# Altium schematic sheet Блок2.SchDoc
size A4
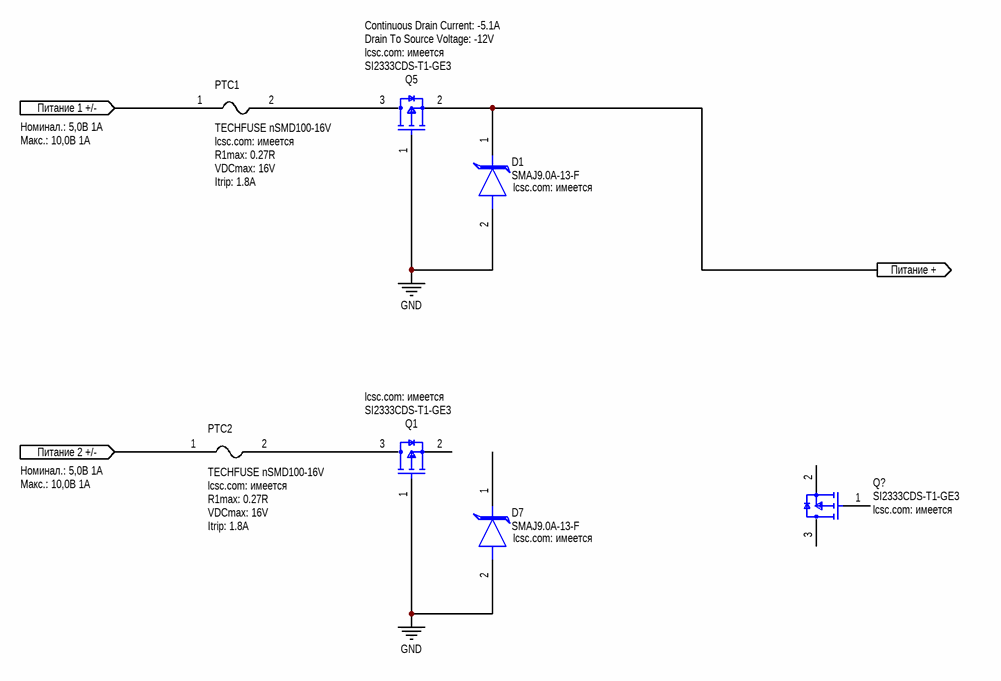
[diagram p0: Блок2.SchDoc]

## Parts
D1  SMAJ9.0A-13-F  lcsc.com: имеется  [FP-SMA-MFG]
D7  SMAJ9.0A-13-F  lcsc.com: имеется  [FP-SMA-MFG]
PTC1  TECHFUSE nSMD100-16V  lcsc.com: имеется  R1max: 0.27R  VDCmax: 16V  Itrip: 1.8A  [nSMD100-16V]
PTC2  TECHFUSE nSMD100-16V  lcsc.com: имеется  R1max: 0.27R  VDCmax: 16V  Itrip: 1.8A  [nSMD100-16V]
Q1  SI2333CDS-T1-GE3  lcsc.com: имеется  [FP-S-03946-MFG]
Q5  SI2333CDS-T1-GE3  Continuous Drain Current: -5.1A  Drain To Source Voltage: -12V  lcsc.com: имеется  [FP-S-03946-MFG]
Q?  SI2333CDS-T1-GE3  lcsc.com: имеется  [FP-S-03946-MFG]

## Ports
Питание 1 +/- (in), Питание 2 +/- (in), Питание + (out)

## Nets
GND: D1.2(A) D7.2(A) Q1.1(G) Q5.1(G)
Питание 1 +/-: PTC1.1 ; port Питание 1 +/-
Питание 2 +/-: PTC2.1 ; port Питание 2 +/-
Питание +: D1.1(C) Q5.2(S) ; port Питание +
NetPTC1_2: PTC1.2 Q5.3(D)
NetPTC2_2: PTC2.2 Q1.3(D)

Not connected (* = marked no-connect by the designer): D7 1(C); Q1 2(S); Q? 1(G) 2(S) 3(D)

## Library data of the parts
D1 D7 = CMP-12828-000014-1: TVS DIODE 9V 15.4V SMA; Manufacturer: Diodes Inc; Number Of Channels: 1; Standoff Height: 0.05mm; Max Junction Temp: +150°C; Direction: Unidirectional; Breakdown Voltage: 10V; Peak Pulse Current: 26A; Peak Pulse Power: 400W; Category: Diode; Footprint Url: https://www.diodes.com/assets/Package-Files/SMA.pdf; Lead Free: Yes; Mouser Description: TVS Diodes - Transient Voltage Suppressors 400W 9.0V; Automotive: No; Temperature Range Low: -55°C; Temperature Range High: +150°C; Manufacturer Part Number: SMAJ9.0A-13-F; RoHS: TRUE; Octopart: https://octopart.com/smaj9.0a-13-f-diodes+inc.-350369; Device Class L3: unset; Device Class L2: TVS Diodes; Clamping Voltage: 15.4V; Temperature: -55°C to +150°C; ComponentLink2Description: Datasheet; Package: SMA; Reverse Standoff Voltage: 9V; Digikey Description: TVS DIODE 9V 15.4V SMA; Height: 2.4mm; ComponentLink2URL: https://www.diodes.com/assets/Datasheets/ds19005.pdf; Device Class L1: Circuit Protection; lcsc.com link: https://lcsc.com/product-detail/TVS_Diodes-Incorporated-SMAJ9-0CA-13-F_C135023.html
Q1 Q? = CMP-02550-000209-1: MOSFET P-CH 12V 7.1A SOT-23; Manufacturer: Vishay; Gate To Source Voltage: 8V; Pulse Drain Current: -20A; Transconductance: 18.5S; Drain To Source Breakdown Voltage: -12V; Turn On Delay Time: 13ns; Turn Off Delay Time: 45ns; Max Forward Diode Voltage: -1.2V; Gate Charge At Vgs: 15nC @ -4.5V; Reverse Recovery Time: 32ns; Depletion Mode: False; Typ Forward Diode Voltage: -0.7V; Drain To Source Resistance: 0.0285Ω; Rthja Max: 75°C/W; Continuous Drain Current: -5.1A; Max Junction Temp: +150°C; Reverse Recovery Charge: 20nC; Number Of Channels: 1; Threshold Vgs Max: -1V; Standoff Height: 0.01mm; Input Capacitace At Vds: 1225pF @ -6V; Power Dissipation: 1.25W; Threshold Vgs Min: -0.4V; Temperature: -55°C to +150°C; Package: S-03946; Lead Free: Yes; Mouser Description: MOSFET 12V 5.1A 2.5W 35 mohms @ 4.5V; ComponentLink2Description: Datasheet; Automotive: No; Ipc Land Pattern Name: SOT95P237X100-3; ComponentLink2URL: http://www.vishay.com/docs/68717/si2333cd.pdf; Octopart: https://octopart.com/si2333cds-t1-ge3-vishay-43171447; Temperature Range High: +150°C; Digikey Description: MOSFET P-CH 12V 7.1A SOT-23; Category: Trans; Device Class L2: Transistors; Manufacturer Part Number: SI2333CDS-T1-GE3; RoHS: TRUE; Drain To Source Voltage: -12V; Device Class L3: MOSFETs; Height: 1.12mm; Number Of P Channels: 1; Temperature Range Low: -55°C; Device Class L1: Discrete Semiconductors; lcsc.com link: https://lcsc.com/product-detail/MOSFETs_Vishay-Intertech-SI2333CDS-T1-GE3_C48179.html
Q5 = CMP-02550-000209-1: MOSFET P-CH 12V 7.1A SOT-23; Manufacturer: Vishay; Gate To Source Voltage: 8V; Pulse Drain Current: -20A; Transconductance: 18.5S; Turn On Delay Time: 13ns; Turn Off Delay Time: 45ns; Max Forward Diode Voltage: -1.2V; Gate Charge At Vgs: 15nC @ -4.5V; Reverse Recovery Time: 32ns; Depletion Mode: False; Typ Forward Diode Voltage: -0.7V; Drain To Source Resistance: 0.0285Ω; Rthja Max: 75°C/W; Max Junction Temp: +150°C; Reverse Recovery Charge: 20nC; Number Of Channels: 1; Threshold Vgs Max: -1V; Standoff Height: 0.01mm; Input Capacitace At Vds: 1225pF @ -6V; Power Dissipation: 1.25W; Threshold Vgs Min: -0.4V; Temperature: -55°C to +150°C; Package: S-03946; Lead Free: Yes; Drain To Source Breakdown Voltage: -12V; Mouser Description: MOSFET 12V 5.1A 2.5W 35 mohms @ 4.5V; ComponentLink2Description: Datasheet; Automotive: No; Ipc Land Pattern Name: SOT95P237X100-3; ComponentLink2URL: http://www.vishay.com/docs/68717/si2333cd.pdf; Octopart: https://octopart.com/si2333cds-t1-ge3-vishay-43171447; Temperature Range High: +150°C; Digikey Description: MOSFET P-CH 12V 7.1A SOT-23; Category: Trans; Device Class L2: Transistors; Manufacturer Part Number: SI2333CDS-T1-GE3; RoHS: TRUE; Device Class L3: MOSFETs; Height: 1.12mm; Number Of P Channels: 1; Temperature Range Low: -55°C; Device Class L1: Discrete Semiconductors; lcsc.com link: https://lcsc.com/product-detail/MOSFETs_Vishay-Intertech-SI2333CDS-T1-GE3_C48179.html
PTC1 PTC2 = TECHFUSE nSMD100-16V: Parameter 1: https://lcsc.com/product-detail/Resettable-Fuses_TECHFUSE-nSMD100-16V_C70082.html